# Altium project nrf5340_qkaa_config2.PrjPCB
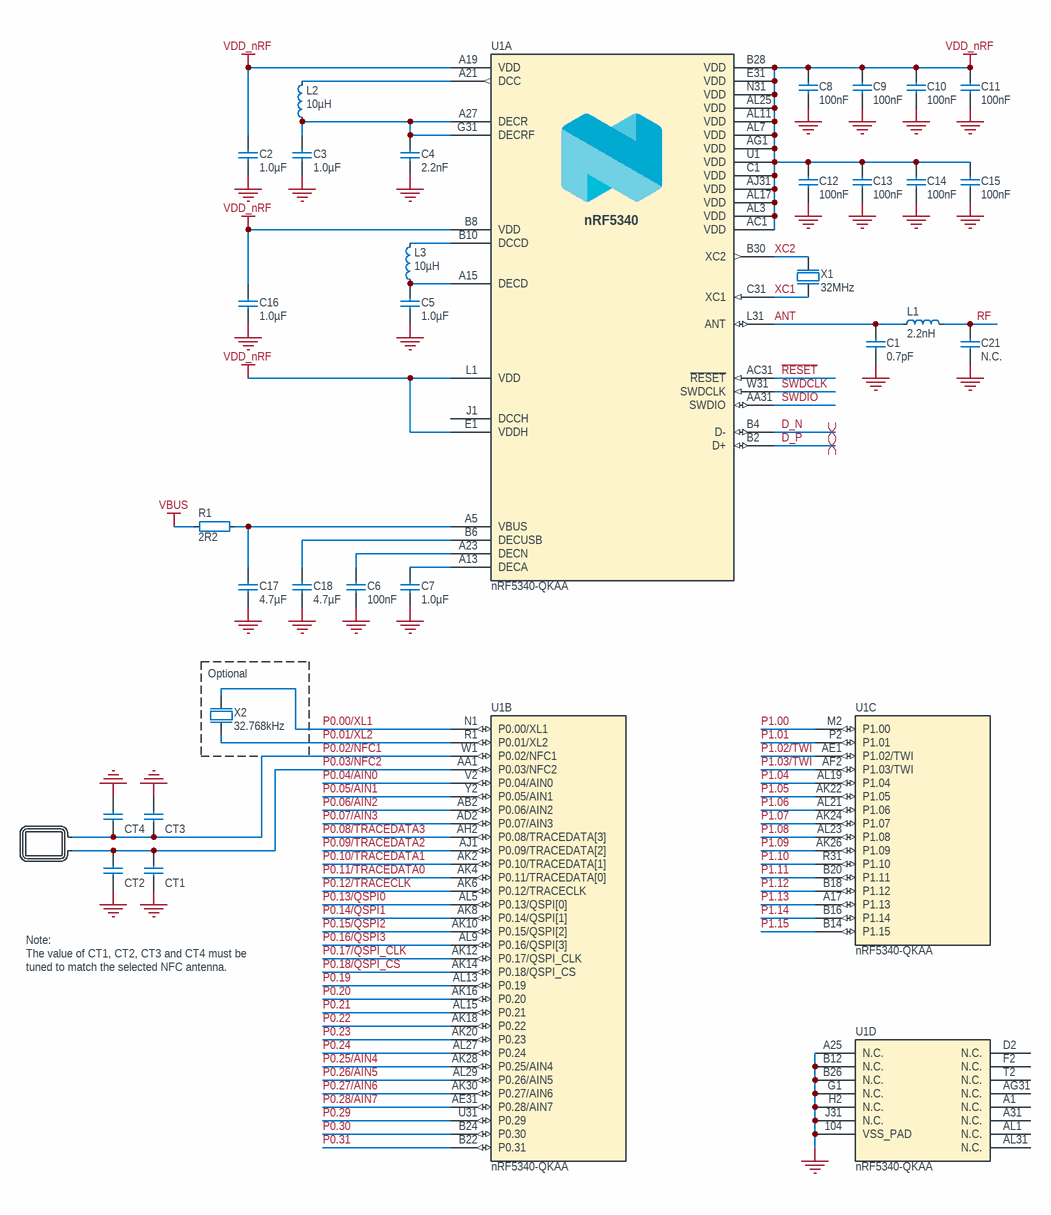
[diagram p0: nrf5340_qkaa_config2.SchDoc]
1 sheet, 31 parts. Net scope: global (net labels, ports and power ports of the same name join across sheets).
Board file: nrf5340_qkaa_config2.PcbDoc

## Sheet nrf5340_qkaa_config2.SchDoc
size A3; BoardTitle: nRF5340-QKAA Reference Layout - Config 2; Organization: Nordic Semiconductor; DocumentNumber: 1; Revision: 1.2; SheetNumber: 1; SheetTotal: 1; DrawnBy: RUBR/GETR/ERSA; DocumentSize: A3; RefLayoutTitle: Reference Layout Config. 2: VDD supply, DCDC, USB, NFC; Device: nRF5340-QKAA; Classification: PUBLIC; ProjectName: nrf5340_qkaa_config2.PrjPCB

### Parts
A1  NFC Antenna  [TP_2x1mm_TH]  (value not drawn)  (no BOM)
C1  0.7pF  [CAPC0603X03L_C]
C2  1.0µF  [CAPC1005X04L]
C3  1.0µF  [CAPC1005X04L]
C4  2.2nF  [CAPC0603X03L_C]
C5  1.0µF  [CAPC1005X04L]
C6  100nF  [CAPC0603X03L_C]
C7  1.0µF  [CAPC1005X04L]
C8  100nF  [CAPC0603X03L_C]
C9  100nF  [CAPC0603X03L_C]
C10  100nF  [CAPC0603X03L_C]
C11  100nF  [CAPC0603X03L_C]
C12  100nF  [CAPC0603X03L_C]
C13  100nF  [CAPC0603X03L_C]
C14  100nF  [CAPC0603X03L_C]
C15  100nF  [CAPC0603X03L_C]
C16  1.0µF  [CAPC1005X04L]
C17  4.7µF  [CAPC1608X06L]
C18  4.7µF  [CAPC1608X06L]
C21  N.C.  [CAPC0603X03L_C_NC]
CT1  Antenna dependent  [CAPC0603X03L_C]  (value not drawn)
CT2  Antenna dependent  [CAPC0603X03L_C]  (value not drawn)
CT3  Antenna dependent  [CAPC0603X03L_C]  (value not drawn)
CT4  Antenna dependent  [CAPC0603X03L_C]  (value not drawn)
L1  2.2nH  [INDC0603X03L_C]
L2  10µH  [INDC1608X06L]
L3  10µH  [INDC1608X06L]
R1  2R2  [RESC0603X03L_C]
U1  nRF5340-QKAA  [AQFN40P700X700X85_HS-99N]  (parts A,B,C,D of 4)
X1  32MHz  [BT-XTAL_2016]
X2  32.768kHz  [XTAL_2012]

### Blocks framed on the sheet
Optional: X2

### Nets
GND: C1.1 C2.2 C3.1 C4.2 C5.1 C6.2 C7.1 C8.2 C9.2 C10.2 C11.2 C12.2 C13.2 C14.2 C15.2 C16.1 C17.2 C18.2 C21.1 CT1.2 CT2.2 CT3.1 CT4.1 U1.104(VSS_PAD) U1.A25(N.C.) U1.B12(N.C.) U1.B26(N.C.) U1.G1(N.C.) U1.H2(N.C.) U1.J31(N.C.) X1.2(GND) X1.4(GND)
VBUS: R1.1
VDD_nRF: C2.1 C8.1 C9.1 C10.1 C11.1 C12.1 C13.1 C14.1 C15.1 C16.2 U1.A19(VDD) U1.AC1(VDD) U1.AG1(VDD) U1.AJ31(VDD) U1.AL3(VDD) U1.AL7(VDD) U1.AL11(VDD) U1.AL17(VDD) U1.AL25(VDD) U1.B8(VDD) U1.B28(VDD) U1.C1(VDD) U1.E1(VDDH) U1.E31(VDD) U1.L1(VDD) U1.N31(VDD) U1.U1(VDD)
ANT: C1.2 L1.2 U1.L31(ANT)
D_N: U1.B4(D-)
D_P: U1.B2(D+)
P0.00/XL1: U1.N1(P0.00/XL1) X2.1(inp)
P0.01/XL2: U1.R1(P0.01/XL2) X2.2(out)
P0.02/NFC1: A1.1 CT3.2 CT4.2 U1.W1(P0.02/NFC1)
P0.03/NFC2: A1.2 CT1.1 CT2.1 U1.AA1(P0.03/NFC2)
P0.04/AIN0: U1.V2(P0.04/AIN0)
P0.05/AIN1: U1.Y2(P0.05/AIN1)
P0.06/AIN2: U1.AB2(P0.06/AIN2)
P0.07/AIN3: U1.AD2(P0.07/AIN3)
P0.08/TRACEDATA3: U1.AH2(P0.08/TRACEDATA[3])
P0.09/TRACEDATA2: U1.AJ1(P0.09/TRACEDATA[2])
P0.10/TRACEDATA1: U1.AK2(P0.10/TRACEDATA[1])
P0.11/TRACEDATA0: U1.AK4(P0.11/TRACEDATA[0])
P0.12/TRACECLK: U1.AK6(P0.12/TRACECLK)
P0.13/QSPI0: U1.AL5(P0.13/QSPI[0])
P0.14/QSPI1: U1.AK8(P0.14/QSPI[1])
P0.15/QSPI2: U1.AK10(P0.15/QSPI[2])
P0.16/QSPI3: U1.AL9(P0.16/QSPI[3])
P0.17/QSPI_CLK: U1.AK12(P0.17/QSPI_CLK)
P0.18/QSPI_CS: U1.AK14(P0.18/QSPI_CS)
P0.19: U1.AL13(P0.19)
P0.20: U1.AK16(P0.20)
P0.21: U1.AL15(P0.21)
P0.22: U1.AK18(P0.22)
P0.23: U1.AK20(P0.23)
P0.24: U1.AL27(P0.24)
P0.25/AIN4: U1.AK28(P0.25/AIN4)
P0.26/AIN5: U1.AL29(P0.26/AIN5)
P0.27/AIN6: U1.AK30(P0.27/AIN6)
P0.28/AIN7: U1.AE31(P0.28/AIN7)
P0.29: U1.U31(P0.29)
P0.30: U1.B24(P0.30)
P0.31: U1.B22(P0.31)
P1.00: U1.M2(P1.00)
P1.01: U1.P2(P1.01)
P1.02/TWI: U1.AE1(P1.02/TWI)
P1.03/TWI: U1.AF2(P1.03/TWI)
P1.04: U1.AL19(P1.04)
P1.05: U1.AK22(P1.05)
P1.06: U1.AL21(P1.06)
P1.07: U1.AK24(P1.07)
P1.08: U1.AL23(P1.08)
P1.09: U1.AK26(P1.09)
P1.10: U1.R31(P1.10)
P1.11: U1.B20(P1.11)
P1.12: U1.B18(P1.12)
P1.13: U1.A17(P1.13)
P1.14: U1.B16(P1.14)
P1.15: U1.B14(P1.15)
~{RESET}: U1.AC31(~{RESET})
RF: C21.2 L1.1
SWDCLK: U1.W31(SWDCLK)
SWDIO: U1.AA31(SWDIO)
XC1: U1.C31(XC1) X1.1(inp)
XC2: U1.B30(XC2) X1.3(out)
NetC3_2: C3.2 C4.1 L2.1 U1.A27(DECR) U1.G31(DECRF)
NetC5_2: C5.2 L3.1 U1.A15(DECD)
NetC6_1: C6.1 U1.A23(DECN)
NetC7_2: C7.2 U1.A13(DECA)
NetC17_1: C17.1 R1.2 U1.A5(VBUS)
NetC18_1: C18.1 U1.B6(DECUSB)
NetL2_2: L2.2 U1.A21(DCC)
NetL3_2: L3.2 U1.B10(DCCD)

Not connected (* = marked no-connect by the designer): U1 A1(N.C.) A31(N.C.) AG31(N.C.) AL1(N.C.) AL31(N.C.) D2(N.C.) F2(N.C.) J1(DCCH) T2(N.C.)

### Layout directives
differential pair: D_N, D_P

### Notes on the sheet
- Note:
  The value of CT1, CT2, CT3 and CT4 must be tuned to match the selected NFC antenna.
- Title
- Size
- Date:
- File:
- A3
- Device
- Sheet         of
- Drawn By:
- Revision
- Classification:
- (in symbol nRF5340-QKAA, part A) nRF5340

### Library data of the parts
A1 = NFC_ANT_TP: Pad Count: 2; Footprint Doc: TP_2x1mm_TH; Value: NFC Antenna; Component Class: Antennas
C1 = C0201-0.7p: Capacitor, NP0, ±0.05pF; Pad Count: 2; Value: 0.7pF; Footprint Doc: 0201; Component Class: Capacitors
C2 C3 C5 C7 C16 = C0402-1µ0-10V-X7S-GRM155C71A105KE11: Capacitor, X7S, ±10%; Pad Count: 2; Value: 1.0µF; Footprint Doc: 0402; Component Class: Capacitors
C4 = C0201-2n2: Capacitor, X7R, ±10%; Pad Count: 2; Value: 2.2nF; Footprint Doc: 0201; Component Class: Capacitors
C6 C8-C15 = C0201-100n-16V-X7S: Capacitor, X7S, ±10%; Pad Count: 2; Value: 100nF; Footprint Doc: 0201; Component Class: Capacitors
C17 = C0603-4µ7-10V-X7S: Capacitor, X7S, ±10%; Pad Count: 2; Value: 4.7µF; Footprint Doc: 0603; Component Class: Capacitors
C18 = C0603-4µ7-6.3V-X7R: Capacitor, X7R, ±10%; Pad Count: 2; Value: 4.7µF; Footprint Doc: 0603; Component Class: Capacitors
C21 = C0201-N.C.: Not mounted; Assembly: Not mounted; Pad Count: 2; Value: N.C.; Footprint Doc: 0201; Component Class: Capacitors
CT1-CT4 = C0201-TBD: Capacitor, NP0, ±5%; Pad Count: 2; Footprint Doc: 0201; Value: Antenna dependent; Component Class: Capacitors
L1 = L0201-2n2: High frequency chip inductor, ±5%; Pad Count: 2; Footprint Doc: 0201; Value: 2.2nH; Component Class: Inductors
L2 L3 = L0603-10µ: Chip Inductor, IDC,min = 50 mA, ±20%; Pad Count: 2; Value: 10µH; Footprint Doc: 0603; Component Class: Inductors
R1 = R0201-2R2: Resistor, ±1%, 0.05W; Pad Count: 2; Footprint Doc: 0201; Value: 2R2; Component Class: Resistors
U1 = nRF5340-QKAA: Multi-protocol Bluetooth Low Energy, IEEE 802.15.4, ANT and 2.4GHz proprietary system-on-chip; Pad Count: 98; Footprint Doc: AQFN-98; Value: nRF5340-QKAA; Component Class: nRF_Devices
X1 = XTAL_SMD2016_32MHz_8pF_General: XTAL SMD 2016, 32MHz, Cl=8pF, Total Tol: ±30ppm; Pad Count: 4; Value: 32MHz; Footprint Doc: XTAL_2016; Component Class: Oscillators
X2 = XTAL_SMD2012_32.768kHz_9pF_General: XTAL SMD 2012, 32.768kHz, Cl=9pF, Total Tol: ±50ppm; Pad Count: 2; Value: 32.768kHz; Footprint Doc: XTAL_2012; Component Class: Oscillators